# Altium schematic sheet RS232.SchDoc
size A; SheetNumber: 4; SheetTotal: 6
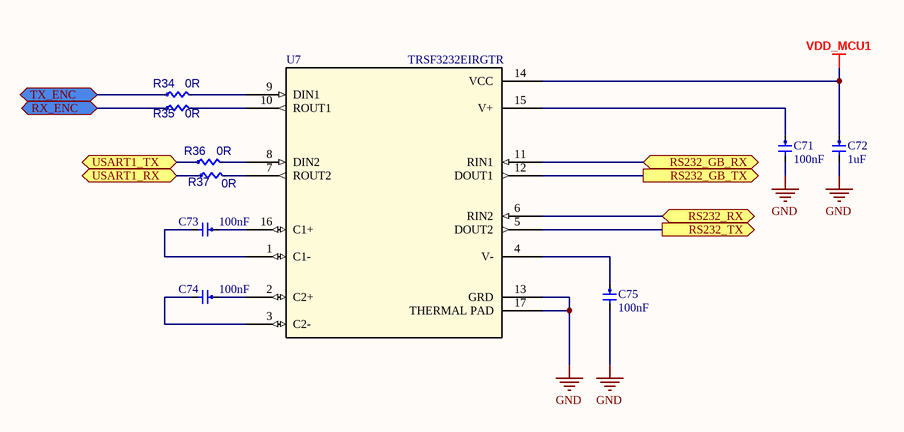
[diagram p0: RS232.SchDoc]

## Parts
C71  Capacitance: 100nF  [CAP0402]  (hidden comment: GRM155R71H104KE14D)
C72  Capacitance: 1uF  [CAP0402]  (hidden comment: CC0402KRX5R8BB105)
C73  Capacitance: 100nF  [CAP0402]  (hidden comment: GRM155R71H104KE14D)
C74  Capacitance: 100nF  [CAP0402]  (hidden comment: GRM155R71H104KE14D)
C75  Capacitance: 100nF  [CAP0402]  (hidden comment: GRM155R71H104KE14D)
R34  Resistance: 0R  [RES0402]  (hidden comment: ERJ-2RKF4701X)
R35  Resistance: 0R  [RES0402]  (hidden comment: ERJ-2RKF4701X)
R36  Resistance: 0R  [RES0402]  (hidden comment: ERJ-2RKF4701X)
R37  Resistance: 0R  [RES0402]  (hidden comment: ERJ-2RKF4701X)
U7  TRSF3232EIRGTR  [TRSF3232EIRGTR]

## Ports
RS232_GB_RX (bidir), RS232_GB_TX (out), RS232_RX (bidir), RS232_TX (out), RX_ENC (bidir), TX_ENC (bidir), USART1_RX (bidir), USART1_TX (bidir)

## Nets
GND: C71.2 C72.2 C75.2 U7.13(GRD) U7.17(THERMAL_PAD)
VDD_MCU1: C72.1 U7.14(VCC)
RS232_GB_RX: U7.11(RIN1) ; port RS232_GB_RX
RS232_GB_TX: U7.12(DOUT1) ; port RS232_GB_TX
RS232_RX: U7.6(RIN2) ; port RS232_RX
RS232_TX: U7.5(DOUT2) ; port RS232_TX
RX_ENC: R35.1 ; port RX_ENC
TX_ENC: R34.1 ; port TX_ENC
USART1_RX: R37.1 ; port USART1_RX
USART1_TX: R36.1 ; port USART1_TX
NetC71_1: C71.1 U7.15(V+)
NetC73_1: C73.1 U7.16(C1+)
NetC73_2: C73.2 U7.1(C1-)
NetC74_1: C74.1 U7.2(C2+)
NetC74_2: C74.2 U7.3(C2-)
NetC75_1: C75.1 U7.4(V-)
NetR34_2: R34.2 U7.9(DIN1)
NetR35_2: R35.2 U7.10(ROUT1)
NetR36_2: R36.2 U7.8(DIN2)
NetR37_2: R37.2 U7.7(ROUT2)

## Library data of the parts
C71 C73-C75 = CMP-01036-1: CAP CER 0.1UF 50V X7R 0402; Manufacturer 1: Murata Electronics; Dielectric Material: Ceramic; Tolerance: 10%; Dissipation Factor: 0.025%; Termination: SMD/SMT; Voltage Rating: 50V; Composition: Ceramic; Max Operating Temperature: 125°C; REACH SVHC: No SVHC; Case/Package: 0402; Case Code (Imperial): 0402; Material: Ceramic; Manufacturer Part Number 1: GRM155R71H104KE14D; Weight: 0.000212oz; Width: 0.5mm; Package Quantity: 10000; Packaging: Tape and Reel; Mount: Surface Mount; Voltage Rating (DC): 50V; Dielectric: X7R; Depth: 0.5mm; Case Code (Metric): 1005; Length: 1mm; Height: 0.5mm; Min Operating Temperature: -55°C; Thickness: 0.022inch; Lead Free: Lead Free; Voltage: 50V
C72 = CMP-00520-1: CAP CER 1UF 25V X5R 0402; Manufacturer 1: TDK Corporation; Tolerance: 10%; Case Code (Imperial): 0402; Case/Package: 0402; Voltage: 25V; Min Operating Temperature: -55°C; Termination: SMD/SMT; Voltage Rating: 25V; Length: 1mm; REACH SVHC: No SVHC; Max Operating Temperature: 85°C; Radiation Hardening: No; Depth: 0.5mm; Case Code (Metric): 1005; Dielectric: X5R; Manufacturer Part Number 1: CC0402KRX5R8BB105; Packaging: Tape and Reel
R34-R37 = CMP-00607-1: RES SMD 4.7K OHM 1% 1/10W 0402; Manufacturer 1: Panasonic Electronic Components; Voltage Rating (DC): 50V; Power Rating: 100mW; Temperature Coefficient: 100ppm/°C; Depth: 0.5mm; Packaging: Tape and Reel; Width: 0.02inch; Case/Package: 0402; Tolerance: 1%; Composition: Thick Film; Case Code (Metric): 1005; Military Standard: Not; Voltage Rating: 50V; Manufacturer Part Number 1: ERJ-2RKF4701X; Number of Pins: 2; Package Quantity: 1; Case Code (Imperial): 0402; Lead Free: Lead Free; Height: 0.35mm; Radiation Hardening: No; Mount: Surface Mount; REACH SVHC: No SVHC; Number of Terminations: 2; Features: Automotive AEC-Q200; Length: 1mm; Min Operating Temperature: -55°C; Max Operating Temperature: 155°C; Max Power Dissipation: 100mW; Contact Plating: Tin; Termination: SMD/SMT
U7 = TRSF3232EIRGTR: No Description Available; Mfr_Name: Texas Instruments; RefDes: RefDes; Type: Type